# Altium schematic sheet T35_0_BlockSch&POWERTREE.SchDoc
size A4
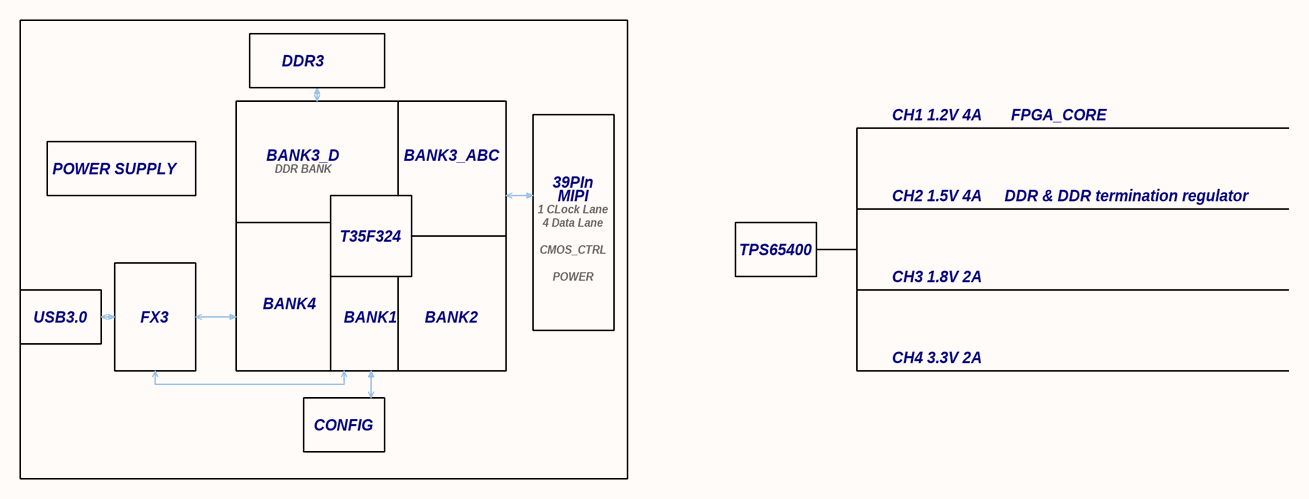
[diagram p0: T35_0_BlockSch&POWERTREE.SchDoc]

## Notes on the sheet
- DDR3
- CH1 1.2V 4A
- FPGA_CORE
- POWER SUPPLY
- BANK3_D
- DDR BANK
- BANK3_ABC
- MIPI
- 39PIn
- CH2 1.5V 4A
- DDR & DDR termination regulator
- T35F324
- 1 CLock Lane
- 4 Data Lane
- CMOS_CTRL
- TPS65400
- USB3.0
- FX3
- BANK4
- BANK1
- BANK2
- POWER
- CH3 1.8V 2A
- CH4 3.3V 2A
- CONFIG